# Altium schematic sheet Power.SchDoc: =Project Title
size A4; Author: Mohamat Eirban Ali; DocumentNumber: 2; Revision: 1; SheetNumber: 1; SheetTotal: 4
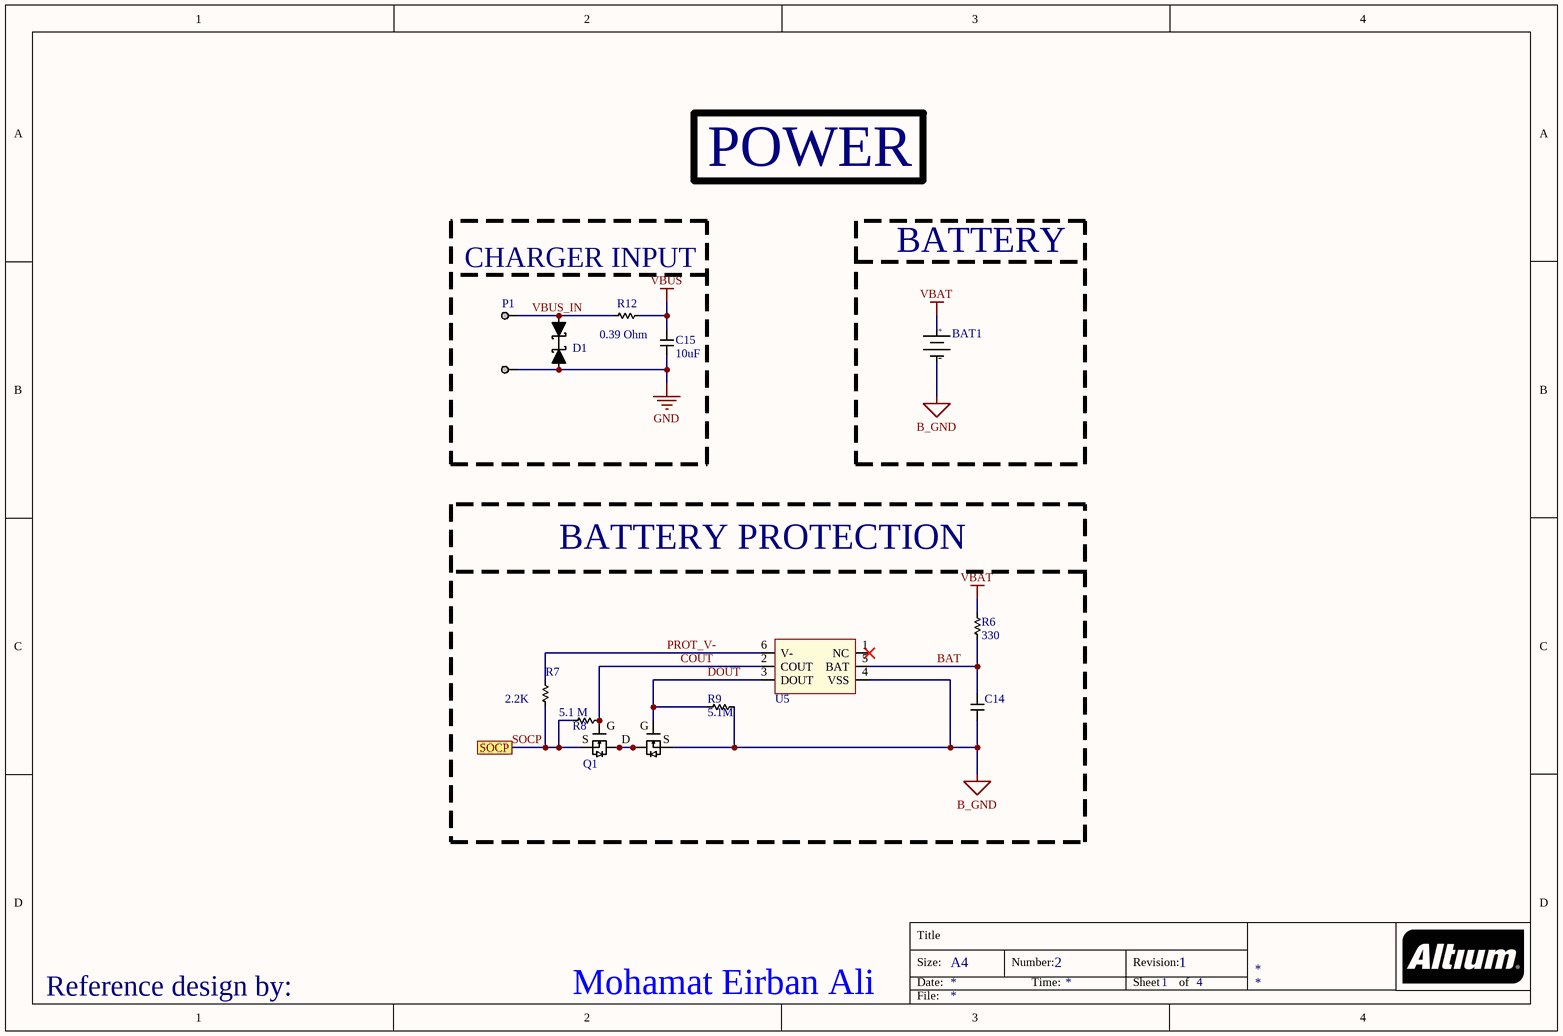
[diagram p0: Power.SchDoc]

## Parts
BAT1  (no value)  [RJD2430C1ST1]
C14  (no value)  [CAP_0603_HIGH]
C15  10uF  [CAP_0603_HIGH]
D1  (no value)  [ESD9B5.0ST5G]
P1  (no value)  [800-10-002-30-507101]
Q1  (no value)  [ECH8693R-TL-W]
R6  330  [RES_0603_HIGH]
R7  2.2K  [RES_0603_HIGH]
R8  5.1 M  [RES_0603_HIGH]
R9  5.1M  [RES_0603_HIGH]
R12  0.39 Ohm  [RES_0805_HIGH]
U5  (no value)  [BQ29700DSER]

## Blocks framed on the sheet
CHARGER INPUT: C15 D1 P1 R12
BATTERY: BAT1
BATTERY PROTECTION: C14 Q1 R6-R9 U5

## Ports
SOCP

## Nets
B_GND: BAT1.2(-) C14.2 Q1.3(S2) R9.1 U5.4(VSS)
GND: C15.2 D1.1 P1.2
VBAT: BAT1.1(+) R6.1
VBUS: C15.1 R12.2
BAT: C14.1 R6.2 U5.5(BAT)
COUT: Q1.2(G1) R8.1 U5.2(COUT)
DOUT: Q1.4(G2) R9.2 U5.3(DOUT)
PROT_V-: R7.1 U5.6(V-)
SOCP: Q1.1(S1) R7.2 R8.2 ; port SOCP
VBUS_IN: D1.2 P1.1 R12.1
NetQ1_5: Q1.5(D) Q1.6(D) Q1.7(D) Q1.8(D)

Not connected (* = marked no-connect by the designer): U5 1(NC)*

## Notes on the sheet
- POWER
- Reference design by:
- Title
- Size:
- Date:
- A4
- Number:
- Time:
- Revision:
- Sheet
- of
- File:
- (in symbol ECH8693R-TL-W) G; S

## Library data of the parts
BAT1 = RJD2430C1ST1: Coin, 24.5mm 3.7V Lithium-Ion Battery Rechargeable (Secondary) 110mAh; Manufacturer 1: CDE Illinois Capacitor; Supplier 1: Digi-Key; Supplier Part Number 1: 1572-1630-ND; Manufacturer Part Number 1: RJD2430C1ST1; Stock 1: 39; Pricing 1: 1=11.09000, 30=8.60200, 60=8.11500, 120=7.68217, 270=7.24941, 510=7.03300 (USD); RoHS: No
C14 = Capacitor_0603: 0603 Capacitor; Manufacturer 1: TDK; Manufacturer Part Number 1: CGA3E2X7R1H104K080AA; Capacitance: 100nF; Tolerance: 10%; Voltage Rating: 50V; Dielectric: X7R; Supplier 1: Digi-Key; Supplier Part Number 1: 445-5666-6-ND; Stock 1: 11655935; Pricing 1: 1=0.10000, 10=0.07500, 100=0.03350, 500=0.02390, 1000=0.01878 (USD); RoHS: Yes; Mount: Surface Mount; Case/Package: 0603; Weight: 7.1E-05oz; Case Code (Imperial): 0603; Case Code (Metric): 1608; Min Operating Temperature: -55°C; Max Operating Temperature: 125°C; Packaging: Tape and Reel; Voltage Rating (DC): 50V; Termination: SMD/SMT; Package Quantity: 1; Voltage: 50V; Composition: Ceramic; Length: 1.6mm; Height: 0.8mm; Width: 0.8mm; Depth: 0.8mm; Thickness: 0.035inch; Ratings: AEC-Q200; Radiation Hardening: No; REACH SVHC: No SVHC; Lead Free: Lead Free; ComponentLink1URL: https://datasheet.ciiva.com/24216/cga3e2x7r1h104k080aa-266291-24216208.pdf?src-supplier=Mouser; ComponentLink1Description: https://datasheet.ciiva.com/24216/cga3e2x7r1h104k080aa-266291-24216208.pdf?src-supplier=Mouser; ComponentLink2URL: https://datasheet.ciiva.com/15192/getdatasheetpartid-715867-15192412.pdf?src-supplier=Verical; ComponentLink2Description: https://datasheet.ciiva.com/15192/getdatasheetpartid-715867-15192412.pdf?src-supplier=Verical; ComponentLink3URL: https://datasheet.ciiva.com/16500/mlccspec-automotive-general-midvoltage-en-16500693.pdf?src-supplier=Future+Electronics; ComponentLink3Description: https://datasheet.ciiva.com/16500/mlccspec-automotive-general-midvoltage-en-16500693.pdf?src-supplier=Future+Electronics; ComponentLink4URL: https://datasheet.ciiva.com/22725/1735392-22725642.pdf?src-supplier=Element14; ComponentLink4Description: https://datasheet.ciiva.com/22725/1735392-22725642.pdf?src-supplier=Element14; ComponentLink5URL: https://datasheet.ciiva.com/23803/1936565-23803084.pdf?src-supplier=Newark; ComponentLink5Description: https://datasheet.ciiva.com/23803/1936565-23803084.pdf?src-supplier=Newark; ComponentLink6URL: https://datasheet.ciiva.com/46385/1735392-46385708.pdf?src-supplier=Element14; ComponentLink6Description: https://datasheet.ciiva.com/46385/1735392-46385708.pdf?src-supplier=Element14
C15 = Capacitor_0603_1: 0603 Capacitor
D1 = ESD9B5.0ST5G: TVS DIODE 5V SOD923; Manufacturer 1: ON Semiconductor; Min Breakdown Voltage: 5.8V; Power Line Protection: No; Clamping Voltage: 12.5V; Peak Pulse Power: 300mW; Capacitance: 15pF; Number of Channels: 1; Peak Pulse Current: 1A; Direction: Bidirectional; Leakage Current: 1uA; Element Configuration: Single; Test Current: 1mA; ESD Protection: Yes; Max Breakdown Voltage: 7.8V; Supplier 1: Digi-Key; Supplier Part Number 1: ESD9B5.0ST5GOSCT-ND; Manufacturer Part Number 1: ESD9B5.0ST5G; Stock 1: 624705; Pricing 1: 1=0.14000, 10=0.13100, 100=0.07120, 500=0.04380, 1000=0.02986 (USD); RoHS: Yes; Case/Package: SOD-923-2; Number of Pins: 2; Contact Plating: Tin; Min Operating Temperature: -55°C; Max Operating Temperature: 150°C; Packaging: Tape and Reel; Reverse Standoff Voltage: 5V; Composition: Zener; Package Quantity: 1; Breakdown Voltage: 5.8V; Termination: SMD/SMT; Operating Supply Voltage: 5V; Max Power Dissipation: 300mW; Working Voltage: 5V; Polarity: Bidirectional; Max Reverse Leakage Current: 1uA; Number of Lines: 1; Reverse Breakdown Voltage: 5.8V; Number of Elements: 1; Number of Bidirectional Channels: 1; Max Surge Current: 1A; Length: 0.8mm; Height: 0.4mm; Depth: 0.6mm; Width: 0.65mm; Radiation Hardening: No; Lead Free: Lead Free; Halogen Free: Halogen Free; REACH SVHC: No SVHC; ComponentLink1URL: https://datasheet.ciiva.com/1219/1596367-1219274.pdf?src-supplier=Newark; ComponentLink1Description: https://datasheet.ciiva.com/1219/1596367-1219274.pdf?src-supplier=Newark; ComponentLink2URL: https://datasheet.ciiva.com/15143/getdatasheetpartid-148214-15143780.pdf?src-supplier=Verical; ComponentLink2Description: https://datasheet.ciiva.com/15143/getdatasheetpartid-148214-15143780.pdf?src-supplier=Verical; ComponentLink3URL: https://datasheet.ciiva.com/3304/esd9b-d-3304010.pdf?src-supplier=Avnet; ComponentLink3Description: https://datasheet.ciiva.com/3304/esd9b-d-3304010.pdf?src-supplier=Avnet; ComponentLink4URL: https://datasheet.ciiva.com/339/esd9b-d-339708.pdf?src-supplier=Digi-Key; ComponentLink4Description: https://datasheet.ciiva.com/339/esd9b-d-339708.pdf?src-supplier=Digi-Key; ComponentLink5URL: https://datasheet.ciiva.com/339/esd9b-d-339707.pdf?src-supplier=Digi-Key; ComponentLink5Description: https://datasheet.ciiva.com/339/esd9b-d-339707.pdf?src-supplier=Digi-Key; ComponentLink6URL: https://datasheet.ciiva.com/4508/esd9b-d-4508620.pdf?src-supplier=Mouser; ComponentLink6Description: https://datasheet.ciiva.com/4508/esd9b-d-4508620.pdf?src-supplier=Mouser
P1 = 800-10-002-30-507101: 2 Position Spring Mating Target Connector Surface Mount; Manufacturer 1: Preci-Dip; Gender: Male; Current Rating: 3.5A; Voltage Rating: 150V; Number of Contacts: 2; Max Voltage Rating (AC): 100V; Pitch: 2.54mm; Supplier 1: Digi-Key; Supplier Part Number 1: 1212-1446-ND; Manufacturer Part Number 1: 800-10-002-30-507101; Stock 1: 803; Pricing 1: 1=0.47000, 10=0.44500, 25=0.40000, 50=0.35560, 100=0.34080, 250=0.31116, 500=0.29634, 1000=0.24448, 2500=0.22226 (USD); RoHS: Yes; Mount: Surface Mount; Contact Material: Brass; Contact Plating: Gold; Material: Brass; Housing Material: Polychlorinated; Housing Color: Black; Min Operating Temperature: -55°C; Max Operating Temperature: 125°C; Number of Rows: 1; Packaging: Bulk; Max Current Rating: 3.5A; Package Quantity: 1710; Termination: Solder; Orientation: Straight; Length: 5.08mm; Height: 4mm; Depth: 2.54mm; ComponentLink1URL: https://datasheet.ciiva.com/11750/0900766b80e0c4e6-11750532.pdf?src-supplier=RSComponents; ComponentLink1Description: https://datasheet.ciiva.com/11750/0900766b80e0c4e6-11750532.pdf?src-supplier=RSComponents; ComponentLink2URL: https://datasheet.ciiva.com/18468/catalog-18468028.pdf?src-supplier=Digi-Key; ComponentLink2Description: https://datasheet.ciiva.com/18468/catalog-18468028.pdf?src-supplier=Digi-Key
Q1 = ECH8693R-TL-W: Mosfet Array 2 N-Channel (Dual) Common Drain 24V 14A 1.4W Surface Mount SOT-28FL/ECH8; Manufacturer 1: ON Semiconductor; Rise Time: 525ns; Rds On Max: 7mR; Turn-On Delay Time: 545ns; Turn-Off Delay Time: 18650ns; Fall Time: 22200ns; Gate to Source Voltage (Vgs): 12.5V; Number of Channels: 2; Supplier 1: Digi-Key; Supplier Part Number 1: ECH8693R-TL-WOSCT-ND; Manufacturer Part Number 1: ECH8693R-TL-W; Stock 1: 2348; Pricing 1: 1=0.58000, 10=0.49500, 100=0.36940, 500=0.29028, 1000=0.22430 (USD); RoHS: Yes; Mount: Surface Mount; Case/Package: SMD/SMT; Number of Pins: 8; Contact Plating: Tin; Min Operating Temperature: -55°C; Max Operating Temperature: 150°C; Packaging: Tape and Reel; Drain to Source Voltage (Vdss): 24V; Continuous Drain Current (ID): 14A; Max Power Dissipation: 1.4W; Drain to Source Breakdown Voltage: 24V; Drain to Source Resistance: 7mR; Package Quantity: 3000; FET Type: 2 N-Channel; Radiation Hardening: No; Lead Free: Lead Free; ComponentLink1URL: https://datasheet.ciiva.com/30022/ech8693r-d-30022230.pdf?src-supplier=Avnet; ComponentLink1Description: https://datasheet.ciiva.com/30022/ech8693r-d-30022230.pdf?src-supplier=Avnet
R6 = Resistor_0603_2: 0603 Resistor
R7 = Resistor_0603_1: 0603 Resistor
R8 R9 = Resistor_0603: 0603 Resistor; Manufacturer 1: Panasonic; Manufacturer Part Number 1: ERJ3GEYJ515V; Resistance: 5.1MR; Tolerance: 5%; Temperature Coefficient: 150ppm/°C; Power Rating: 100mW; Voltage Rating: 75V; Voltage Rating (DC): 50V; Supplier 1: Digi-Key; Supplier Part Number 1: P5.1MGCT-ND; Stock 1: 168591; Pricing 1: 1=0.10000, 10=0.04300, 100=0.01760, 1000=0.00791, 2500=0.00686 (USD); RoHS: Yes; Mount: Surface Mount; Case/Package: 0603; Case Code (Metric): 1608; Case Code (Imperial): 0603; Contact Plating: Tin; Min Operating Temperature: -55°C; Max Operating Temperature: 155°C; Packaging: Tape and Reel; Composition: Thick Film; Number of Terminations: 2; Max Power Dissipation: 100mW; Package Quantity: 1; Termination: SMD/SMT; Features: Automotive AEC-Q200; Military Standard: Not; Length: 1.6mm; Height: 0.45mm; Width: 0.031inch; Depth: 0.8mm; Lead Free: Lead Free; REACH SVHC: No SVHC; ComponentLink1URL: https://datasheet.ciiva.com/24072/aoa0000ce1-37422-24072359.pdf?src-supplier=Mouser; ComponentLink1Description: https://datasheet.ciiva.com/24072/aoa0000ce1-37422-24072359.pdf?src-supplier=Mouser; ComponentLink2URL: https://datasheet.ciiva.com/9195/aoa0000ce1-9195547.pdf?src-supplier=Avnet; ComponentLink2Description: https://datasheet.ciiva.com/9195/aoa0000ce1-9195547.pdf?src-supplier=Avnet; ComponentLink3URL: https://datasheet.ciiva.com/43460/1500035-43460797.pdf?src-supplier=Farnell; ComponentLink3Description: https://datasheet.ciiva.com/43460/1500035-43460797.pdf?src-supplier=Farnell; ComponentLink4URL: https://datasheet.ciiva.com/46448/1500035-46448447.pdf?src-supplier=Element14; ComponentLink4Description: https://datasheet.ciiva.com/46448/1500035-46448447.pdf?src-supplier=Element14
R12 = Resistor_0805: 0805 Resistor
U5 = BQ29700DSER: Battery Battery Protection IC Lithium-Ion/Polymer 6-WSON (1.5x1.5); Manufacturer 1: Texas Instruments; Number of Cells: 1; Fault Protection: Over Current; Operating Supply Voltage: 8V; Supplier 1: Digi-Key; Supplier Part Number 1: 296-43985-1-ND; Manufacturer Part Number 1: BQ29700DSER; Stock 1: 54841; Pricing 1: 1=0.69000, 10=0.60800, 100=0.46650, 500=0.36874, 1000=0.29499 (USD); RoHS: Yes; Mount: Surface Mount; Number of Pins: 6; Weight: 0.000342oz; Contact Plating: Gold; Min Operating Temperature: -40°C; Max Operating Temperature: 85°C; Packaging: Tape and Reel; Package Quantity: 3000; Lead Free: Lead Free; ComponentLink1URL: http://www.ti.com/general/docs/lit/getliterature.tsp?genericPartNumber=BQ2970&amp;&amp;fileType=pdf&src-supplier=Avnet+Asia; ComponentLink1Description: http://www.ti.com/general/docs/lit/getliterature.tsp?genericPartNumber=BQ2970&amp;&amp;fileType=pdf&src-supplier=Avnet+Asia; ComponentLink2URL: http://www.ti.com/general/docs/lit/getliterature.tsp?genericPartNumber=BQ2970&&fileType=pdf&src-supplier=Avnet; ComponentLink2Description: http://www.ti.com/general/docs/lit/getliterature.tsp?genericPartNumber=BQ2970&&fileType=pdf&src-supplier=Avnet; ComponentLink3URL: http://www.ti.com/lit/gpn/bq2970?src-supplier=Mouser; ComponentLink3Description: http://www.ti.com/lit/gpn/bq2970?src-supplier=Mouser; ComponentLink4URL: http://www.ti.com/lit/ds/symlink/bq2971.pdf?src-supplier=Digi-Key; ComponentLink4Description: http://www.ti.com/lit/ds/symlink/bq2971.pdf?src-supplier=Digi-Key